# EAGLE design morseSounder (EAGLE 9.1.3)
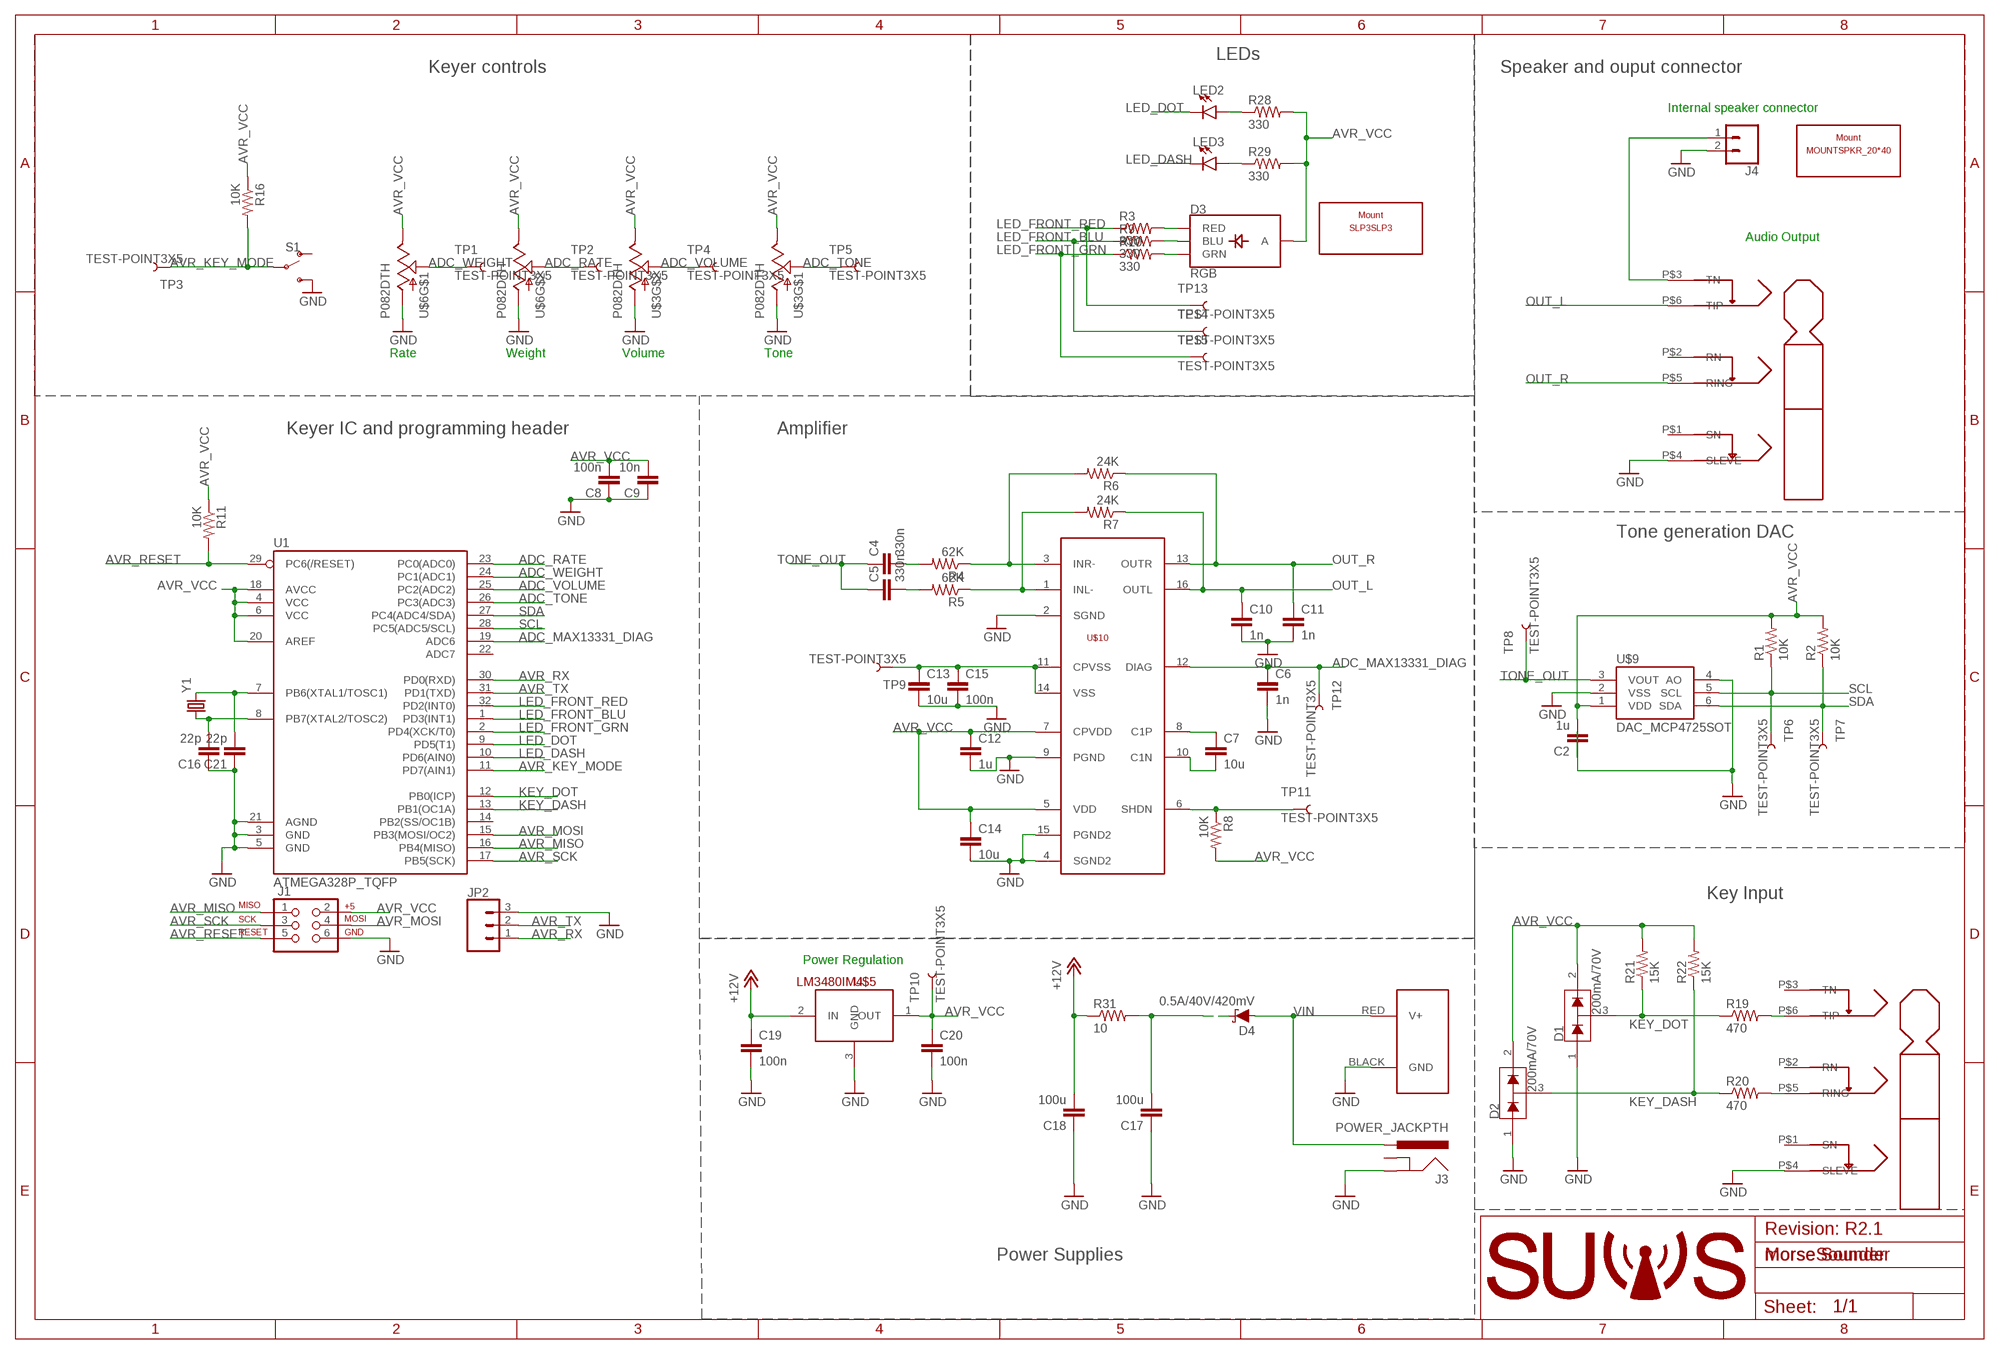
[diagram p0: schematic, sheet 1]

## Parts
C2  1u  CAP0805  [0805]
C4  330n  CAP0805  [0805]
C5  330n  CAP0805  [0805]
C6  1n  CAP0805  [0805]
C7  10u  CAP0805  [0805]
C8  100n  CAP0805  [0805]
C9  10n  CAP0805  [0805]
C10  1n  CAP0805  [0805]
C11  1n  CAP0805  [0805]
C12  1u  CAP0805  [0805]
C13  10u  CAP0805  [0805]
C14  10u  CAP0805  [0805]
C15  100n  CAP0805  [0805]
C16  22p  CAP0805  [0805]
C17  100u  CAP0805  [0805]
C18  100u  CAP0805  [0805]
C19  100n  CAP0805  [0805]
C20  100n  CAP0805  [0805]
C21  22p  CAP0805  [0805]
D1  200mA/70V  BAV99  [SOT23-3]
D2  200mA/70V  BAV99  [SOT23-3]
D3  RGB  LED-RGB-CACREE  [P-LCC-4-3]
D4  0.5A/40V/420mV  DIODE-SCHOTTKY-PMEG4005EJ  [SOD-323]
J1  AVR_SPI_PRG_6PTH  [2X3]
J2  POWERPOLE_POWER25A_HORIZONTAL_G2  [POWERPOLE_PAIR_25A_HORIZ_G2]
J3  POWER_JACKPTH  [POWER_JACK_PTH]
J4  CONN_02  [1X02]
JP2  CONN_03  [1X03]
LED2  LED-RED1206  [LED-1206]
LED3  LED-RED1206  [LED-1206]
R1  10K  RESISTOR0805-RES  [0805]
R2  10K  RESISTOR0805-RES  [0805]
R3  330  RESISTOR0805-RES  [0805]
R4  62K  RESISTOR0805-RES  [0805]
R5  62K  RESISTOR0805-RES  [0805]
R6  24K  RESISTOR0805-RES  [0805]
R7  24K  RESISTOR0805-RES  [0805]
R8  10K  RESISTOR0805-RES  [0805]
R9  330  RESISTOR0805-RES  [0805]
R10  330  RESISTOR0805-RES  [0805]
R11  10K  RESISTOR0805-RES  [0805]
R16  10K  RESISTOR0805-RES  [0805]
R19  470  RESISTOR0805-RES  [0805]
R20  470  RESISTOR0805-RES  [0805]
R21  15K  RESISTOR0805-RES  [0805]
R22  15K  RESISTOR0805-RES  [0805]
R28  330  RESISTOR0805-RES  [0805]
R29  330  RESISTOR0805-RES  [0805]
R31  10  RESISTOR0805-RES  [0805]
S1  SWITCH-SPDTTE-1825232-1  [TE-1825232-1]
TP1  TEST-POINT3X5  [PAD.03X.05]
TP2  TEST-POINT3X5  [PAD.03X.05]
TP3  TEST-POINT3X5  [PAD.03X.05]
TP4  TEST-POINT3X5  [PAD.03X.05]
TP5  TEST-POINT3X5  [PAD.03X.05]
TP6  TEST-POINT3X5  [PAD.03X.05]
TP7  TEST-POINT3X5  [PAD.03X.05]
TP8  TEST-POINT3X5  [PAD.03X.05]
TP9  TEST-POINT3X5  [PAD.03X.05]
TP10  TEST-POINT3X5  [PAD.03X.05]
TP11  TEST-POINT3X5  [PAD.03X.05]
TP12  TEST-POINT3X5  [PAD.03X.05]
TP13  TEST-POINT3X5  [PAD.03X.05]
TP14  TEST-POINT3X5  [PAD.03X.05]
TP15  TEST-POINT3X5  [PAD.03X.05]
U1  ATMEGA328P_TQFP  [TQFP32-08]
U$1  NRJ6HH  [NRJ6HH]
U$2  NRJ6HH  [NRJ6HH]
U$3  P082DTH  [P082D]
U$4  MOUNTSPKR_20*40  [SKR_MNT]
U$5  LM3480IM4  [SOT23-3]
U$6  P082DTH  [P082D]
U$7  LOGO_SUWSLOGO_LARGE  [LOGO_SUWS]
U$8  SLP3SLP3  [SLP-3]
U$9  DAC_MCP4725SOT  [SOT23-6]
U$10  MAX13331  [SSOP16]
Y1  CRYSTALHC49UV  [HC49U-V]

## Nets
+12V: C18.2 C19.1 R31.1 U$5.2(IN)
ADC_MAX13331_DIAG: C6.1 TP12.P$1 U1.19(ADC6) U$10.12(DIAG)
ADC_RATE: TP2.P$1 U1.23(PC0(ADC0)) U$6.R2(S)
ADC_TONE: TP5.P$1 U1.26(PC3(ADC3)) U$3.F2(S)
ADC_VOLUME: TP4.P$1 U1.25(PC2(ADC2)) U$3.R2(S)
ADC_WEIGHT: TP1.P$1 U1.24(PC1(ADC1)) U$6.F2(S)
AVR_KEY_MODE: R16.2 S1.2(P) TP3.P$1 U1.11(PD7(AIN1))
AVR_MISO: J1.1 U1.16(PB4(MISO))
AVR_MOSI: J1.4 U1.15(PB3(MOSI/OC2))
AVR_RESET: J1.5 R11.2 U1.29(PC6(/RESET))
AVR_RX: JP2.1 U1.30(PD0(RXD))
AVR_SCK: J1.3 U1.17(PB5(SCK))
AVR_TX: JP2.2 U1.31(PD1(TXD))
AVR_VCC: C2.2 C8.2 C9.2 C12.1 C14.1 C20.1 D1.2(C2) D2.2(C2) D3.1(A) J1.2 R1.2 R2.2 R8.2 R11.1 R16.1 R21.2 R22.2 R28.2 R29.2 TP10.P$1 U1.4(VCC) U1.6(VCC) U1.18(AVCC) U1.20(AREF) U$3.F3(E) U$3.R3(E) U$5.1(OUT) U$6.F3(E) U$6.R3(E) U$9.1(VDD) U$10.5(VDD) U$10.7(CPVDD)
GND: C2.1 C6.2 C8.1 C9.1 C10.2 C11.2 C12.2 C13.2 C14.2 C15.2 C16.1 C17.1 C18.1 C19.2 C20.2 C21.1 D1.1(A1) D2.1(A1) J1.6 J2.BLACK(GND) J3.GND J4.2 JP2.3 S1.3(S) U1.3(GND) U1.5(GND) U1.21(AGND) U$1.P$4(SLEVE) U$2.P$4(SLEVE) U$3.F1(A) U$3.R1(A) U$5.3(GND) U$6.F1(A) U$6.R1(A) U$9.2(VSS) U$9.4(AO) U$10.2(SGND) U$10.4(SGND2) U$10.9(PGND) U$10.15(PGND2)
KEY_DASH: D2.3(COM) R20.1 R22.1 U1.13(PB1(OC1A))
KEY_DOT: D1.3(COM) R19.1 R21.1 U1.12(PB0(ICP))
LED_DASH: LED3.C U1.10(PD6(AIN0))
LED_DOT: LED2.C U1.9(PD5(T1))
LED_FRONT_BLU: R9.1 TP14.P$1 U1.1(PD3(INT1))
LED_FRONT_GRN: R10.1 TP15.P$1 U1.2(PD4(XCK/T0))
LED_FRONT_RED: R3.1 TP13.P$1 U1.32(PD2(INT0))
N$1: C21.2 U1.7(PB6(XTAL1/TOSC1)) Y1.2
N$2: C16.2 U1.8(PB7(XTAL2/TOSC2)) Y1.1
N$3: D3.3(GRN) R10.2
N$4: C17.2 D4.C R31.2
N$5: C4.2 R4.2
N$6: C5.2 R5.2
N$7: R4.1 R6.2 U$10.3(INR-)
N$8: R5.1 R7.2 U$10.1(INL-)
N$10: R20.2 U$1.P$5(RING)
N$15: D3.4(BLU) R9.2
N$16: C7.1 U$10.8(C1P)
N$17: C7.2 U$10.10(C1N)
N$18: R19.2 U$1.P$6(TIP)
N$19: D3.2(RED) R3.2
N$20: R8.1 TP11.P$1 U$10.6(SHDN)
N$23: C13.1 C15.1 TP9.P$1 U$10.11(CPVSS) U$10.14(VSS)
N$28: J4.1 U$2.P$3(TN)
N$29: LED3.A R29.1
N$33: LED2.A R28.1
OUT_L: C10.1 R7.1 U$2.P$6(TIP) U$10.16(OUTL)
OUT_R: C11.1 R6.1 U$2.P$5(RING) U$10.13(OUTR)
SCL: R1.1 TP6.P$1 U1.28(PC5(ADC5/SCL)) U$9.5(SCL)
SDA: R2.1 TP7.P$1 U1.27(PC4(ADC4/SDA)) U$9.6(SDA)
TONE_OUT: C4.1 C5.1 TP8.P$1 U$9.3(VOUT)
VIN: D4.A J2.RED(V+) J3.PWR
Unconnected: J3.GNDBREAK S1.1(O) U1.14(PB2(SS/OC1B)) U1.22(ADC7) U$1.P$1(SN) U$1.P$2(RN) U$1.P$3(TN) U$2.P$1(SN) U$2.P$2(RN)

## Notes on the sheet
- LEDs
- Keyer controls | Speaker and ouput connector
- Internal speaker connector
- Audio Output
- Rate | Weight | Volume | Tone
- Keyer IC and programming header | Amplifier
- Tone generation DAC
- Key Input
- Power Regulation
- Revision: R2.1
- Power Supplies | Morse Sounder

## Library data of the parts
C2 C4-C21 = SparkFun:CAP: Capacitor Standard 0603 ceramic capacitor, and 0.1" leaded capacitor.
D1 D2 = SparkFun-DiscreteSemi:BAV99: Series-pair diode array Two small signal silicon diodes connected anode to cathode. Connections to all three nodes available. Link to datasheet <https://www.fairchildsemi.com/datasheets/BA/BAV99.pdf> SparkFun Products: SparkFun AutoDriver <https://www.sparkfun.com/products/13752>; PROD_ID: DIO-10647
D3 = morseSounder:LED-RGB-CA
D4 = SparkFun-DiscreteSemi:DIODE-SCHOTTKY: Schottky diode A Schottky diode is a semiconductor diode which has a low forward voltage drop and a very fast switching action.; PROD_ID: DIO-10955
J1 = SparkFun:AVR_SPI_PRG_6: AVR ISP 6 Pin This is the reduced ISP connector for AVR programming. Common on Arduino. This footprint will take up less PCB space and can be used with a 10-pin to 6-pin adapter such as SKU: BOB-08508
J2 = powerpoles:POWERPOLE_POWER: Anderson Powerpole Power Connector using ameteur radio standard layout
J3 = SparkFun:POWER_JACK: Power Jack This is the standard 5.5mm barrel jack for power. The PTH is the most common, proven, reliable, footprint. All others are experimental. The Slot footprint only works if the mill layer is transmitted to the PCB fab house so be warned. Spark Fun Electronics SKU : PRT-00119. Mating wall wart : TOL-00298 (and others)
J4 = SparkFun-Connectors:CONN_02: Multi connection point. Often used as Generic Header-pin footprint for 0.1 inch spaced/style header connections On any of the 0.1 inch spaced packages, you can populate with these: Break Away Headers - Straight <https://www.sparkfun.com/products/116> (PRT-00116) Break Away Male Headers - Right Angle <https://www.sparkfun.com/products/553> (PRT-00553) Female Headers <https://www.sparkfun.com/products/115> (PRT-00115) Break Away Headers - Machine Pin <https://www.sparkfun.com/products/117> (PRT-00117) Break Away Female Headers - Swiss Machine Pin <https://www.sparkfun.com/products/743> (PRT-00743) For SCREWTERMINALS and SPRING TERMINALS visit here: Screw Terimnals on SparkFun.com <https://www.sparkfun.com/search/results?term=Screw+Terminals> (5mm/3.5mm/2.54mm spacing) This device is also useful as a general connection point to wire up your design to another part of your project. Our various solder wires solder well into these plated through hole pads. Hook-Up Wire - Assortment (Stranded, 22 AWG) <https://www.sparkfun.com/products/11375> (PRT-11375) Hook-Up Wire - Assortment (Solid Core, 22 AWG) <https://www.sparkfun.com/products/11367> (PRT-11367) View the entire wire category on our website here <https://www.sparkfun.com/categories/141> Special notes: Molex polarized connector foot print use with: PRT-08233 with associated crimp pins and housings. 2.54_SCREWTERM for use with PRT-10571. 3.5mm Screw Terminal footprints for PRT-08084 5mm Screw Terminal footprints for use with PRT-08432
JP2 = SparkFun-Connectors:CONN_03: Multi connection point. Often used as Generic Header-pin footprint for 0.1 inch spaced/style header connections On any of the 0.1 inch spaced packages, you can populate with these: Break Away Headers - Straight <https://www.sparkfun.com/products/116> (PRT-00116) Break Away Male Headers - Right Angle <https://www.sparkfun.com/products/553> (PRT-00553) Female Headers <https://www.sparkfun.com/products/115> (PRT-00115) Break Away Headers - Machine Pin <https://www.sparkfun.com/products/117> (PRT-00117) Break Away Female Headers - Swiss Machine Pin <https://www.sparkfun.com/products/743> (PRT-00743) Stackable Header - 3 Pin (Female, 0.1") <https://www.sparkfun.com/products/13875> (PRT-13875) For SCREWTERMINALS and SPRING TERMINALS visit here: Screw Terimnals on SparkFun.com <https://www.sparkfun.com/search/results?term=Screw+Terminals> (5mm/3.5mm/2.54mm spacing) This device is also useful as a general connection point to wire up your design to another part of your project. Our various solder wires solder well into these plated through hole pads. Hook-Up Wire - Assortment (Stranded, 22 AWG) <https://www.sparkfun.com/products/11375> (PRT-11375) Hook-Up Wire - Assortment (Solid Core, 22 AWG) <https://www.sparkfun.com/products/11367> (PRT-11367) View the entire wire category on our website here <https://www.sparkfun.com/categories/141> Special notes: Molex polarized connector foot print use with SKU : PRT-08232 with associated crimp pins and housings.
LED2 LED3 = SparkFun-LED:LED-RED: Red SMD LED Used in manufacturing of most products at SparkFun Packages: 0603 - SMD 0603 package [Product Link] <http://docs.avagotech.com/docs/AV02-0551EN> 0603 SMART - SMD 0603 SMART package ( more efficient and expensive)[Product Link] <http://www.osram-os.com/Graphics/XPic2/00077099_0.pdf> 1206 - SMD1206 package [Product Link] <https://www.sparkfun.com/datasheets/DevTools/LilyPad/Q150OVS4.pdff> SparkFun Products: Pro Mini 328 -5V <https://www.sparkfun.com/products/821> RedBoard <https://www.sparkfun.com/products/12757> IOIO-OTG <https://www.sparkfun.com/products/13613>; PROD_ID: DIO-09912; VALUE: RED
R1-R11 R16 R19-R22 R28 R29 R31 = SparkFun:RESISTOR: Resistor Basic schematic elements and footprints for 0603, 1206, and PTH resistors.
S1 = morseSounder:SWITCH-SPDT
TP1-TP15 = SparkFun-Connectors:TEST-POINT: SparkFun Test Points Bare copper test points for troubleshooting or In-Circuit-Testing. These are used by our Production team for verifying production board runs using pogo-pins on test beds. SparkFun Products: SparkFun LSM9DS1 Breakout <https://www.sparkfun.com/products/13284> SparkFun PSOC <https://www.sparkfun.com/products/13714> SparkFun Load Cell Amplifier <https://www.sparkfun.com/products/13879>
U1 = SparkFun-IC-Microcontroller:ATMEGA328P_TQFP: Popular 328P in QFP Storefront component: ATmega328 - TQFP <https://www.sparkfun.com/products/13448> (COM-13448) Datasheet <http://www.sparkfun.com/datasheets/Components/SMD/ATMega328.pdf> SparkFun Products SparkFun RedBoard - Programmed with Arduino <https://www.sparkfun.com/products/12757> (DEV-12757) Arduino Pro Mini 328 - 5V/16MHz <https://www.sparkfun.com/products/11113> (DEV-11113) Arduino Pro Mini 328 - 3.3V/8MHz <https://www.sparkfun.com/products/11114> (DEV-11114) SparkFun OpenLog <https://www.sparkfun.com/products/13712> (DEV-13712) SparkFun MicroView - OLED Arduino Module <https://www.sparkfun.com/products/12923> (DEV-12923) SparkFun Digital Sandbox <https://www.sparkfun.com/products/12651> (DEV-12651) SparkFun PicoBoard <https://www.sparkfun.com/products/11888> (WIG-11888) Arduino Fio <https://www.sparkfun.com/products/10116> (DEV-10116) LilyPad Arduino 328 Main Board <https://www.sparkfun.com/products/13342> (DEV-13342) SparkFun RedStick <https://www.sparkfun.com/products/13741> (DEV-13741) LilyPad MP3 <https://www.sparkfun.com/products/11013> (DEV-11013) LilyPad Arduino SimpleSnap <https://www.sparkfun.com/products/10941> (DEV-10941) SparkFun Stepoko <https://www.sparkfun.com/products/13899> (ROB-13899) SparkFun Geiger Counter <https://www.sparkfun.com/products/11345> (SEN-11345) SparkFun EL Sequencer <https://www.sparkfun.com/products/12781> (COM-12781) Arduino Pro 328 - 5V/16MHz <https://www.sparkfun.com/products/10915> (DEV-10915) CryptoCape <https://www.sparkfun.com/products/12773> (DEV-12773) SparkFun IR Thermometer Evaluation Board - MLX90614 <https://www.sparkfun.com/products/10740> (SEN-10740) SparkFun RedBot Mainboard <https://www.sparkfun.com/products/12097> (ROB-12097) Arduino Pro 328 - 3.3V/8MHz <https://www.sparkfun.com/products/10914> (DEV-10914) SparkFun Block for Intel® Edison - Arduino <https://www.sparkfun.com/products/13036> (DEV-13036) SparkFun Simon Says - Surface Mount Soldering Kit <https://www.sparkfun.com/products/10935> (KIT-10935) SparkFun 7-Segment Serial Display - Red <https://www.sparkfun.com/products/11441> (COM-11441) SparkFun 7-Segment Serial Display - White <https://www.sparkfun.com/products/11629> (COM-11629) SparkFun 7-Segment Serial Display - Yellow <https://www.sparkfun.com/products/11443> (COM-11443) SparkFun 7-Segment Serial Display - Kelly Green <https://www.sparkfun.com/products/11440> (COM-11440) SparkFun 7-Segment Serial Display - Blue <https://www.sparkfun.com/products/11442> (COM-11442) SparkFun OpenSegment Serial Display - 20mm (Blue) <https://www.sparkfun.com/products/11647> (COM-11647) SparkFun OpenSegment Serial Display - 20mm (Green) <https://www.sparkfun.com/products/11646> (COM-11646) SparkFun OpenSegment Serial Display - 20mm (White) <https://www.sparkfun.com/products/11648> (COM-11648) SparkFun OpenSegment Serial Display - 20mm (Red) <https://www.sparkfun.com/products/11644> (COM-11644) SparkFun OpenSegment Serial Display - 20mm (Yellow) <https://www.sparkfun.com/products/11645> (COM-11645) SparkFun OpenSegment Shield <https://www.sparkfun.com/products/13190> (DEV-13190); PROD_ID: IC-09069
U$1 U$2 = morseSounder:NRJ6HH
U$3 U$6 = morseSounder:P082D
U$4 = morseSounder:MOUNT
U$5 = SparkFun-PowerIC:LM3480IM4: Small package linear regulator
U$7 = morseSounder:LOGO_SUWS
U$8 = morseSounder:SLP3
U$9 = SparkFun:DAC_MCP4725
U$10 = morseSounder:MAX13331
Y1 = SparkFun:CRYSTAL: Crystals Various standard crystals. Proven footprints. Spark Fun Electronics SKU : COM-00534

## Board
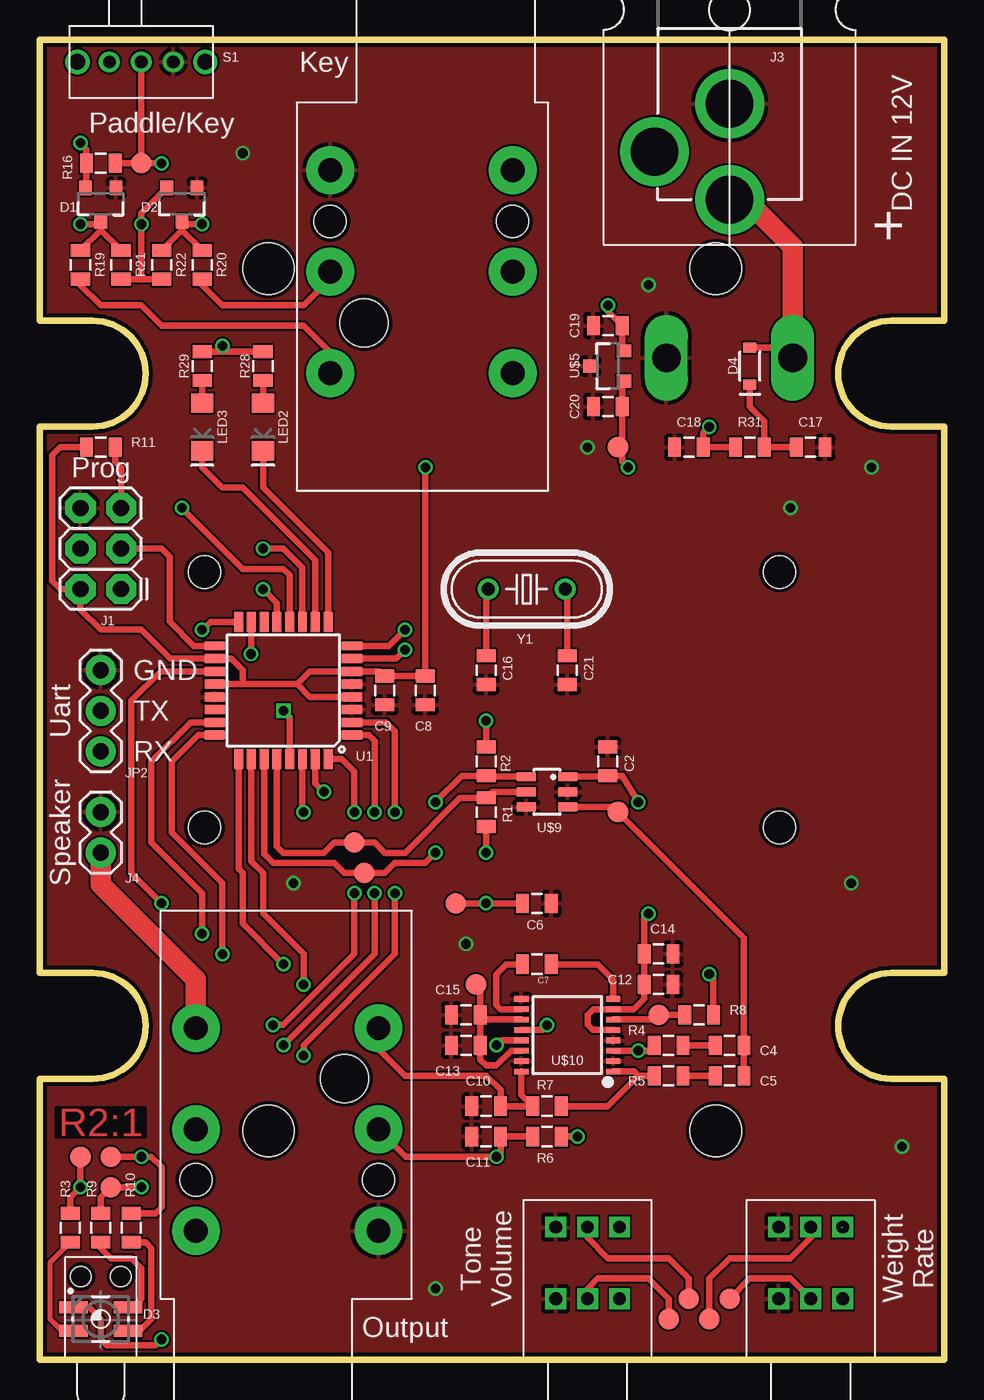
[diagram p1: board, top side]
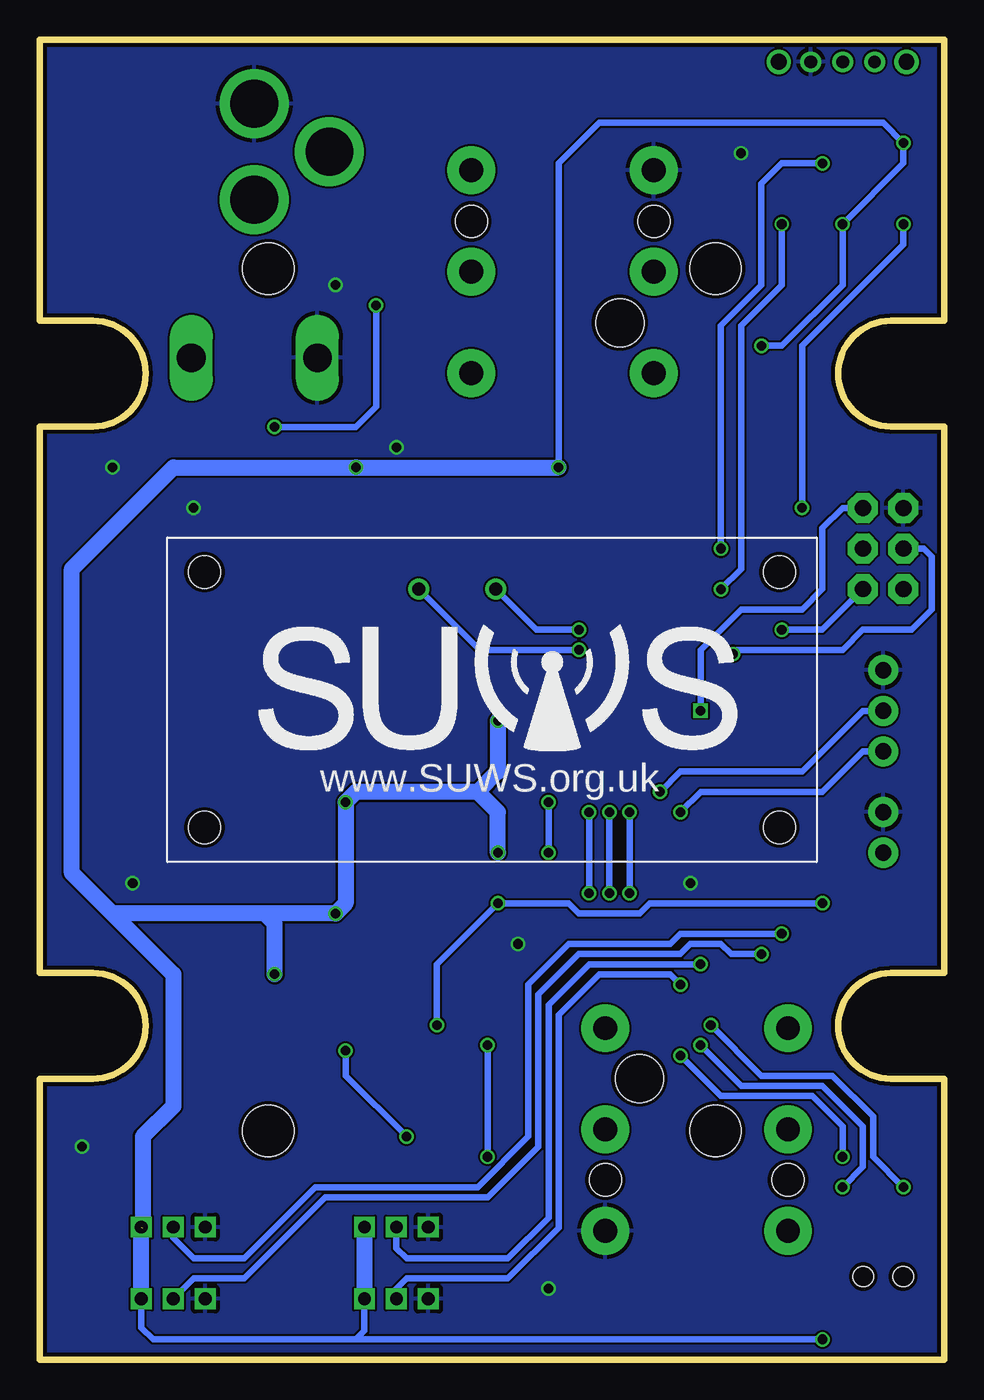
[diagram p2: board, bottom side, seen from below]

Size 56.61 x 82.66 mm. Coordinates in mm from the lower left corner, seen from the top.
Outline: 0,0 56.61,0 56.61,17.59 53.3,17.59 arc-180 53.3,24.21 56.61,24.21 56.61,58.45 53.3,58.45 arc-180 53.3,65.08 56.61,65.08 56.61,82.66 0,82.66 0,65.08 3.31,65.08 arc-180 3.31,58.45 0,58.45 0,24.21 3.31,24.21 arc-180 3.31,17.59 0,17.59 0,0
Copper layers (1*16): Top 0.035mm / dielectric 1.5mm / Bottom 0.035mm
Design rules "dirt_cheap_dirty_boards.v1": minimum track width 5mil, minimum drill 12mil, track to track 5mil, track to pad 5mil, pad to pad 5mil, via to via 5mil, smd to smd 0mil, copper to edge 10mil, drill to drill 10mil, minimum pad ring 10mil, minimum via ring 6mil, stop-mask expansion 2mil, vias tented up to drill 25mil, thermal gap 10mil
Holes 3.2 mm at 14.31,14.33 42.31,14.33 42.31,68.33 14.31,68.33

### Footprints (pad centres in the part's own frame; a part is rotated, then mirrored left to right if it is on the bottom)
0805 = smd 0.8 x 1.2: 1 -0.9,0; 2 0.9,0
SOT23-3 = smd 0.8 x 0.9: 1 -0.95,-1; 2 0.95,-1; 3 0,1.1
P-LCC-4-3 = smd 1.8 x 0.75: 1 -1.7,0.725; 2 -1.7,-0.725; 3 1.7,-0.725; 4 1.7,0.725
SOD-323 = smd 0.63 x 0.83: A 1.15,0; C -1.15,0
2X3 = drill 1.016 pad 1.88 octagon: 1 0,0; 2 0,2.54; 3 2.54,0; 4 2.54,2.54; 5 5.08,0; 6 5.08,2.54
POWERPOLE_PAIR_25A_HORIZ_G2 = drill 1.8 long: BLACK -3.95,-7.1; RED 3.95,-7.1
POWER_JACK_PTH = drill 2.997 pad 4.318: GND 0,7.7; GNDBREAK 4.7,10.7; PWR 0,13.7
1X02 = drill 1.016 pad 1.88: 1 0,0; 2 2.54,0
1X03 = drill 1.016 pad 1.88: 1 0,0; 2 2.54,0; 3 5.08,0
LED-1206 = smd 1.2 x 1.4: A -1.5,0; C 1.5,0
TE-1825232-1 = drill 0.8: 1 -2,0; 2 0,0; 3 2,0 | drill 1: M1 -4,0; M2 4,0
PAD.03X.05 = smd 1.27 x 1.27: P$1 0,0
TQFP32-08 = smd 1.27 x 0.559: 1 -4.293,2.8; 2 -4.293,2; 3 -4.293,1.2; 4 -4.293,0.4; 5 -4.293,-0.4; 6 -4.293,-1.2; 7 -4.293,-2; 8 -4.293,-2.8; 17 4.293,-2.8; 18 4.293,-2; 19 4.293,-1.2; 20 4.293,-0.4; 21 4.293,0.4; 22 4.293,1.2; 23 4.293,2; 24 4.293,2.8 | smd 0.559 x 1.27: 9 -2.8,-4.293; 10 -2,-4.293; 11 -1.2,-4.293; 12 -0.4,-4.293; 13 0.4,-4.293; 14 1.2,-4.293; 15 2,-4.293; 16 2.8,-4.293; 25 2.8,4.293; 26 2,4.293; 27 1.2,4.293; 28 0.4,4.293; 29 -0.4,4.293; 30 -1.2,4.293; 31 -2,4.293; 32 -2.8,4.293
NRJ6HH = drill 1.5 pad 3: P$1 4.25,4.2; P$2 10.6,4.2; P$3 16.95,4.2; P$4 4.25,-7.23; P$5 10.6,-7.23; P$6 16.95,-7.23 | hole 2: 7.45,4.2; 7.45,-7.23 | hole 3: 13.8,-5.1
P082D = drill 0.8 square: F1 -2,3.8; F2 0,3.8; F3 2,3.8; R1 -2,8.3; R2 0,8.3; R3 2,8.3
SKR_MNT = hole 2: -8,18; -8,-18; 8,-18; 8,18
SLP-3 = hole 1.27: -1.25,5.2; 1.25,5.2
SOT23-6 = smd 0.55 x 1.2: 1 0.95,-1.3; 2 0,-1.3; 3 -0.95,-1.3; 4 -0.95,1.3; 5 0,1.3; 6 0.95,1.3
SSOP16 = smd 0.9 x 0.35: 1 -2.875,2.275; 2 -2.875,1.625; 3 -2.875,0.975; 4 -2.875,0.325; 5 -2.875,-0.325; 6 -2.875,-0.975; 7 -2.875,-1.625; 8 -2.875,-2.275; 9 2.875,-2.275; 10 2.875,-1.625; 11 2.875,-0.975; 12 2.875,-0.325; 13 2.875,0.325; 14 2.875,0.975; 15 2.875,1.625; 16 2.875,2.275
HC49U-V = drill 0.813: 1 -2.413,0; 2 2.413,0

### Placement (x,y rotation side)
C2  35.56,37.47 270 top
C4  43.18,19.68 180 top
C5  43.18,17.78 180 top
C6  31.11,28.57 0 top
C7  1u  [0805]  31.11,24.77 180 top
C8  24.13,41.91 90 top
C9  21.59,41.91 90 top
C10  27.94,15.88 180 top
C11  27.94,13.97 180 top
C12  38.73,23.5 0 top
C13  1u  [0805]  26.67,19.68 180 top
C14  100n  [0805]  38.73,25.4 0 top
C15  26.67,21.59 180 top
C16  27.94,43.18 90 top
C17  48.26,57.15 180 top
C18  40.64,57.15 0 top
C19  35.56,64.77 180 top
C20  35.56,59.69 180 top
C21  33.02,43.18 90 top
D1  3.81,72.39 180 top
D2  8.89,72.39 180 top
D3  3.81,2.54 0 top
D4  44.45,62.23 90 top
J1  5.08,48.26 90 top
J2  43.18,69.85 0 top
J3  43.18,86.36 180 top
J4  3.81,31.75 90 top
JP2  3.81,38.1 90 top
LED2  13.97,58.42 270 top
LED3  10.16,58.42 270 top
R1  27.94,34.29 270 top
R2  27.94,37.47 90 top
R3  1.91,8.26 270 top
R4  30K  [0805]  39.37,19.68 0 top
R5  30K  [0805]  39.37,17.78 0 top
R6  45K  [0805]  31.75,13.97 0 top
R7  45K  [0805]  31.75,15.88 0 top
R8  41.27,21.59 0 top
R9  3.81,8.26 270 top
R10  5.71,8.26 270 top
R11  3.81,57.15 0 top
R16  3.81,74.93 0 top
R19  2.54,68.58 270 top
R20  10.16,68.58 270 top
R21  5.08,68.58 270 top
R22  7.62,68.58 270 top
R28  13.97,62.23 90 top
R29  10.16,62.23 90 top
R31  44.45,57.15 0 top
S1  6.35,81.28 0 top
TP1  43.18,3.81 0 top
TP2  41.91,2.54 0 top
TP3  6.35,74.93 90 top
TP4  40.64,3.81 0 top
TP5  39.37,2.54 0 top
TP6  19.68,32.38 0 top
TP7  20.32,30.48 0 top
TP8  36.2,34.29 0 top
TP9  27.3,23.5 0 top
TP10  36.2,57.15 0 top
TP11  38.73,21.59 0 top
TP12  26.04,28.57 0 top
TP13  2.54,12.7 0 top
TP14  4.45,10.79 0 top
TP15  4.45,12.7 0 top
U1  15.24,41.91 180 top
U$1  25.4,78.74 270 top
U$2  13.97,3.81 90 top
U$3  34.29,0 0 top
U$4  28.3,41.33 90 bottom
U$5  35.56,62.23 90 top
U$6  48.26,0 0 top
U$7  42.93,38.1 0 bottom
U$8  3.81,0 0 top
U$9  31.75,35.56 90 top
U$10  33.02,20.32 180 top
Y1  30.48,48.26 0 top

### Tracks (layer width: path | path; a pad name or v marks a point on that pad's centre or on a via)
+12V  (via drill 0.6)
  Top 0.406: R31.1 C18.2 41.54,58.05 v41.91,58.42 | U$5.2 36.46,63.28 C19.1 35.56,65.67 v35.56,66.04
  Bottom 0.406: v41.91,58.42 36.83,58.42 35.56,59.69 v35.56,66.04
ADC_MAX13331_DIAG  (via drill 0.6)
  Top 0.406: U$10.12 31.44,20.64 v31.75,20.95 | TP12.P$1 v27.94,28.57 C6.1 | U1.19 7.55,43.11 5.71,41.27 5.71,30.48 v7.62,28.57
  Bottom 0.406: v31.75,20.95 31.75,24.77 v27.94,28.57 23.5,28.57 22.86,27.94 19.05,27.94 18.41,28.57 v7.62,28.57
ADC_RATE  (via drill 0.6)
  Top 0.406: U$6.R2 48.26,7.62 46.99,6.35 43.18,6.35 41.91,5.08 TP2.P$1 | U1.23 9.43,39.91 6.99,37.47 6.99,32.38 10.16,29.21 v10.16,26.67
  Bottom 0.406: v10.16,26.67 16.51,26.67 17.14,26.04 23.5,26.04 26.04,23.5 26.04,13.97 29.21,10.79 39.37,10.79 43.81,6.35 46.99,6.35 48.26,7.62 U$6.R2
ADC_TONE  (via drill 0.6)
  Top 0.406: U1.26 13.24,31.21 13.97,30.48 13.97,27.94 16.51,25.4 v16.51,23.5 | TP5.P$1 39.37,3.81 38.1,5.08 34.92,5.08 34.29,4.45 U$3.F2
  Bottom 0.406: U$3.F2 34.29,4.45 33.66,5.08 27.3,5.08 24.13,8.26 24.13,21.59 21.59,24.13 17.14,24.13 v16.51,23.5
ADC_VOLUME  (via drill 0.6)
  Top 0.406: TP4.P$1 40.64,5.08 39.37,6.35 35.56,6.35 34.29,7.62 U$3.R2 | U1.25 12.44,30.74 12.7,30.48 12.7,27.3 v15.24,24.77
  Bottom 0.406: U$3.R2 34.29,6.99 33.66,6.35 27.3,6.35 24.77,8.89 24.77,22.23 22.23,24.77 v15.24,24.77
ADC_WEIGHT  (via drill 0.6)
  Top 0.406: U$6.F2 46.99,5.08 44.45,5.08 TP1.P$1 | U1.24 9.9,39.11 8.26,37.47 8.26,33.02 11.43,29.84 v11.43,25.4
  Bottom 0.406: v11.43,25.4 13.34,25.4 13.97,26.04 15.88,26.04 16.51,25.4 22.86,25.4 25.4,22.86 25.4,13.34 28.57,10.16 38.73,10.16 43.81,5.08 46.98,5.08 U$6.F2
AVR_KEY_MODE  (via drill 0.6)
  Top 0.406: S1.2 TP3.P$1 | TP3.P$1 R16.2 | TP3.P$1 v7.62,74.93 | U1.11 16.44,49.6 15.24,50.8 v13.97,50.8
  Bottom 0.406: v7.62,74.93 10.16,74.93 11.43,73.66 11.43,67.31 13.97,64.77 v13.97,50.8
AVR_MISO  (via drill 0.6)
  Top 0.406: U1.16 10.69,46.2 v10.16,45.72
  Bottom 0.406: v10.16,45.72 7.62,45.72 J1.1
AVR_MOSI  (via drill 0.6)
  Top 0.406: U1.15 13.24,44.16 v13.21,44.2
  Bottom 0.406: v13.21,44.2 12.95,44.45 6.35,44.45 5.08,45.72 2.03,45.72 0.76,46.99 0.76,50.29 1.27,50.8 J1.4
AVR_RESET  (via drill 0.6)
  Top 0.406: R11.2 4.71,56.25 5.08,55.88 J1.5 | U1.29 15.64,40.24 v15.24,40.64
  Bottom 0.406: v15.24,40.64 15.24,44.45 12.7,46.99 8.89,46.99 7.62,48.26 7.62,52.07 6.35,53.34 J1.5
AVR_RX  (via drill 0.6)
  Top 0.406: U1.30 16.44,34.36 v16.51,34.29
  Bottom 0.406: v16.51,34.29 15.24,35.56 7.62,35.56 5.08,38.1 JP2.1
AVR_SCK
  Top 0.406: U1.17 9.65,44.71 8.13,46.23 8.13,50.29 7.62,50.8 J1.3
AVR_TX  (via drill 0.6)
  Top 0.406: U1.31 17.24,36.1 v17.78,35.56
  Bottom 0.406: v17.78,35.56 16.51,36.83 8.89,36.83 5.08,40.64 JP2.2
AVR_VCC  (via drill 0.6)  (1 unrouted)
  Top 0.406: R21.2 R22.2 6.49,67.68 6.35,67.82 v6.35,71.12 6.35,71.8 D2.2 | v2.54,76.2 2.91,75.83 R16.1 2.91,73.44 D1.2 | R28.2 R29.2 11.06,63.13 v11.43,63.5 | U$5.1 36.46,61.18 C20.1 36.46,57.15 | 36.46,57.15 36.46,56.25 v36.83,55.88 | U1.20 12.7,42.31 | 12.7,42.31 16.11,42.31 | U1.4 16.91,41.51 16.11,42.31 | 16.11,42.31 16.91,43.11 U1.6 21.29,43.11 C9.2 C8.2 v24.13,55.88 | 12.7,42.31 12.7,43.18 11.97,43.91 U1.18 8.16,43.91 6.35,45.72 3.81,45.72 2.54,46.99 J1.2 1.27,48.26 0.76,48.77 0.76,56.64 1.27,57.15 R11.1 | TP10.P$1 36.46,57.15 | U$10.5 34.6,20.64 34.29,20.95 34.29,21.59 34.65,21.95 U$10.7 37.19,21.95 37.84,22.59 C12.1 C14.1 37.84,27.68 v38.1,27.94 | R8.2 42.17,23.86 v41.91,24.13 | v37.47,34.92 36.46,36.56 C2.2 35.51,36.51 U$9.1 | R1.2 v27.94,31.75 | R2.2 v27.94,40.01 | D3.1 3.08,3.27 3.81,2.54 3.81,1.27 4.19,0.89 7.24,0.89 v7.62,1.27
  Bottom 0.406: v11.43,63.5 10.16,63.5 6.35,67.31 v6.35,71.12 2.54,74.93 v2.54,76.2 3.81,77.47 21.59,77.47 24.13,74.93 v24.13,55.88 | U$3.F3 36.29,1.81 36.83,1.27 | 36.83,1.27 49.53,1.27 50.26,2 U$6.F3 | v7.62,1.27 36.83,1.27
  Bottom 1: U$6.F3 U$6.R3 | U$3.R3 U$3.F3
  Bottom 1.016: 52.07,27.94 48.26,24.13 48.26,15.88 50.16,13.97 50.16,8.26 | 52.07,27.94 54.61,30.48 54.61,49.53 48.26,55.88 v36.83,55.88 v24.13,55.88 | 42.55,27.94 v38.1,27.94 37.47,28.57 v37.47,34.92 36.83,35.56 29.21,35.56 | 42.55,27.94 52.07,27.94 | v41.91,24.13 41.91,27.3 42.55,27.94 | v27.94,31.75 27.94,34.29 29.21,35.56 | v27.94,40.01 27.94,36.83 29.21,35.56
GND  (via drill 0.6)
  other vias: 52.07,55.88 34.29,57.15 15.88,29.84 50.8,29.84 46.99,53.34 12.7,75.56 38.1,67.31 24.77,4.45 53.98,13.34 26.67,26.04
  pour Top: -2.54,-2.54 59.69,-2.54 59.69,85.09 -2.54,85.09
  pour Bottom: -1.27,-3.81 58.42,-3.81 58.42,83.82 -1.27,83.82
KEY_DASH  (via drill 0.6)
  Top 0.406: 8.89,70.75 R20.1 | 8.89,70.75 D2.3 9.06,71.12 v10.16,71.12 | 8.89,70.75 R22.1 | U1.13 14.84,47.39 v13.97,48.26
  Bottom 0.406: v13.97,48.26 12.7,49.53 12.7,64.77 10.16,67.31 v10.16,71.12
KEY_DOT  (via drill 0.6)
  Top 0.406: 3.81,70.75 R21.1 | 3.81,70.75 D1.3 3.64,71.12 v2.54,71.12 | 3.81,70.75 R19.1 | U1.12 15.64,49.13 15.24,49.53 12.7,49.53 v8.89,53.34
  Bottom 0.406: v8.89,53.34 8.89,63.5 2.54,69.85 v2.54,71.12
LED_DASH
  Top 0.406: U1.10 17.24,50.07 12.7,54.61 11.43,54.61 10.16,55.88 LED3.C
LED_DOT
  Top 0.406: U1.9 18.04,50.54 13.97,54.61 LED2.C
LED_FRONT_BLU  (via drill 0.6)
  Top 0.406: U1.1 20.58,39.11 20.95,38.73 v20.95,34.29 | v20.95,29.21 20.95,25.4 v15.24,19.68 | v6.35,10.79 TP14.P$1 3.81,10.16 R9.1
  Bottom 0.406: v20.95,34.29 v20.95,29.21 | v15.24,19.68 12.7,17.14 7.62,17.14 5.08,14.61 5.08,12.06 v6.35,10.79
LED_FRONT_GRN  (via drill 0.6)
  Top 0.406: U1.2 21.68,39.91 22.23,39.37 v22.23,34.29 | v22.23,29.21 22.23,25.4 16.51,19.68 v16.51,19.05 | TP15.P$1 v6.35,12.7 6.99,12.7 7.62,12.06 7.62,9.53 7.25,9.15 R10.1
  Bottom 0.406: v22.23,34.29 v22.23,29.21 | v6.35,12.7 6.35,14.61 8.26,16.51 13.97,16.51 v16.51,19.05
LED_FRONT_RED  (via drill 0.6)
  Top 0.406: U1.32 18.9,37.62 19.68,36.83 v19.68,34.29 | v19.68,29.21 19.68,25.4 15.24,20.95 v14.61,20.95 | TP13.P$1 v2.54,10.79 1.91,10.16 R3.1
  Bottom 0.406: v19.68,34.29 v19.68,29.21 | v14.61,20.95 11.43,17.78 6.99,17.78 4.45,15.24 4.45,12.7 v2.54,10.79
N$1  (via drill 0.6)
  Top 0.406: Y1.2 33.02,48.26 C21.2 | U1.7 22.32,43.91 v22.86,44.45
  Bottom 0.406: v22.86,44.45 29.08,44.45 Y1.2
N$2  (via drill 0.6)
  Top 0.406: Y1.1 27.94,48.26 C16.2 | U1.8 21.85,44.71 v22.86,45.72
  Bottom 0.406: v22.86,45.72 25.53,45.72 Y1.1
N$3
  Top 0.406: D3.3 6.26,1.81 6.99,2.54 6.99,6.99 6.62,7.36 R10.2
N$4
  Top 0.406: 47.13,57.38 C17.2 R31.2 45.35,58.79 44.45,59.69 D4.C
N$5
  Top 0.406: R4.2 C4.2
N$6
  Top 0.406: R5.2 C5.2
N$7  (via drill 0.6)
  Top 0.406: U$10.3 36.83,19.34 v37.47,19.34 38.13,19.34 R4.1 | R6.2 v33.66,13.97
  Bottom 0.406: v33.66,13.97 37.47,17.78 v37.47,19.34
N$8
  Top 0.406: R5.1 37.47,17.78 | 37.47,17.78 35.56,15.88 R7.2 | U$10.1 37.2,18.05 37.47,17.78
N$10
  Top 0.406: U$1.P$5 18.17,67.7 16.51,66.04 11.43,66.04 10.16,67.31 R20.2
N$15
  Top 0.406: R9.2 3.81,6.99 4.45,6.35 5.71,6.35 6.35,5.71 6.35,3.81 5.8,3.27 D3.4
N$16
  Top 0.406: U$10.8 35.9,23.8 34.92,24.77 C7.1
N$17
  Top 0.406: U$10.10 28.86,21.95 28.57,22.23 28.57,24.13 29.21,24.77 C7.2
N$18
  Top 0.406: U$1.P$6 18.17,63.11 16.51,64.77 7.62,64.77 6.35,66.04 3.81,66.04 2.54,67.31 R19.2
N$19
  Top 0.305: 1.36,1.81 0.64,2.54 0.64,6.08 R3.2
  Top 0.406: D3.2 1.36,1.81
N$20
  Top 0.406: U$10.6 38.44,21.3 TP11.P$1 R8.1
N$23
  Top 0.406: U$10.11 27.86,21.3 C15.1 | U$10.14 29.5,19.34 28.57,18.41 27.94,18.41 27.57,18.79 C13.1 C15.1 | C15.1 27.57,23.23 TP9.P$1
N$28
  Top 1.27: U$2.P$3 9.77,23.81 3.81,29.77 J4.1
N$29
  Top 0.406: LED3.A R29.1
N$33
  Top 0.406: LED2.A R28.1
OUT_L
  Top 0.406: U$2.P$6 21.2,19.44 22.86,17.78 27.94,17.78 28.84,16.88 C10.1 R7.1 30.14,16.58 U$10.16
OUT_R  (via drill 0.6)
  Top 0.406: U$2.P$5 22.91,12.7 v28.57,12.7 28.84,12.96 C11.1 R6.1 | U$10.13 28.89,20 v28.57,19.68
  Bottom 0.406: v28.57,19.68 v28.57,12.7
SCL
  Top 0.406: U1.28 14.84,32.15 15.24,31.75 17.78,31.75 18.41,32.38 TP6.P$1 20.95,32.38 21.59,31.75 22.86,31.75 26.3,35.19 R1.1 28.31,35.56 U$9.5
SDA  (via drill 0.6)
  Top 0.406: U1.27 14.04,31.68 14.61,31.11 18.41,31.11 19.05,30.48 TP7.P$1 21.59,30.48 22.23,31.11 24.13,31.11 v24.77,31.75 | U$9.6 28,36.51 R2.1 26.41,36.56 v24.77,34.92
  Bottom 0.406: v24.77,31.75 v24.77,34.92
TONE_OUT
  Top 0.406: U$9.3 35.88,34.61 TP8.P$1 44.08,26.41 C4.1 C5.1
VIN
  Top 0.406: D4.A 46.5,63.38 J2.RED
  Top 1.27: J3.PWR 44.18,72.66 47.13,69.71 J2.RED

### Text on the board
Top: R2:1
tPlace: Key | Paddle/Key | Prog | GND | Uart | TX | RX | Speaker | Output
tNames: DC IN 12V | Tone / Volume | Weight / Rate
bNames: www.SUWS.org.uk
tStop: R2:1